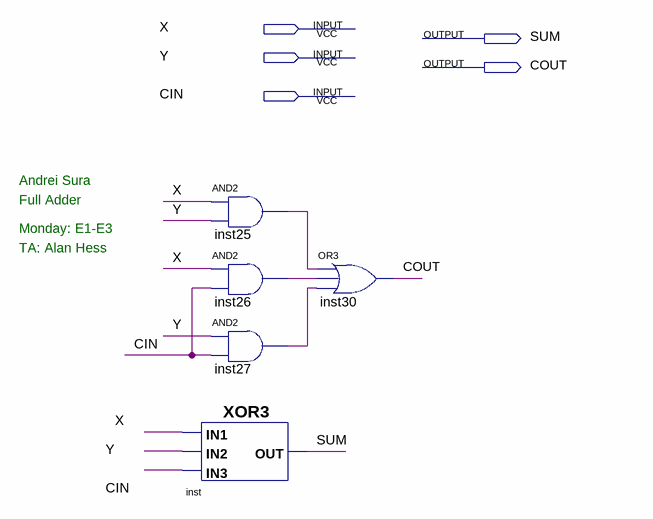
[diagram p0: schematic sheet]
// Quartus schematic full_adder.bdf as structural Verilog: 5 symbols, 5 pins
module full_adder (
  input  X,
  input  Y,
  input  CIN,
  output SUM,
  output COUT
);

  wire inst25_out, inst26_out, inst27_out;

  XOR3 inst (.IN3(CIN), .IN1(X), .IN2(Y), .OUT(SUM));
  and inst25 (inst25_out, X, Y);
  and inst26 (inst26_out, X, CIN);
  and inst27 (inst27_out, Y, CIN);
  or inst30 (COUT, inst25_out, inst26_out, inst27_out);

  // Notes on the sheet:
  //   Andrei Sura
  //   Full Adder
  //   Monday: E1-E3
  //   TA: Alan Hess
endmodule
